# Altium project DCAR_MOTOR.PrjPcb
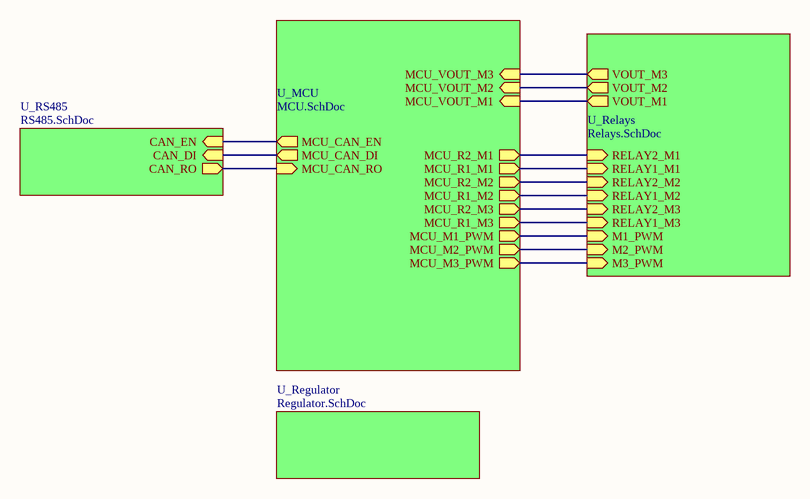
[diagram p0: Relay_top.SchDoc]
prjVersion: 2.0
5 sheets, 172 parts. Net scope: hierarchical (ports join the sheet entries above them; power ports are global).
Board file: PCB1.PcbDoc
Sheets:
  Relay_top.SchDoc
    U_MCU = MCU.SchDoc
    U_Relays = Relays.SchDoc
    U_RS485 = RS485.SchDoc
    U_Regulator = Regulator.SchDoc

## Sheet Relay_top.SchDoc: DCAR
size A4; DocumentNumber: 1; Revision: 2.0; SheetNumber: 1; SheetTotal: 5

### Sub-sheets
U_MCU = MCU.SchDoc: MCU_VOUT_M3 (in), MCU_VOUT_M1 (in), MCU_VOUT_M2 (in), MCU_CAN_RO (in), MCU_CAN_DI (out), MCU_CAN_EN (out), MCU_R2_M1 (out), MCU_R1_M1 (out), MCU_R2_M2 (out), MCU_R1_M2 (out), MCU_R2_M3 (out), MCU_R1_M3 (out), MCU_M1_PWM (out), MCU_M2_PWM (out), MCU_M3_PWM (out)
U_Regulator = Regulator.SchDoc: no entries
U_Relays = Relays.SchDoc: VOUT_M1 (out), VOUT_M3 (out), VOUT_M2 (out), RELAY2_M1 (in), RELAY1_M1 (in), RELAY2_M2 (in), RELAY1_M2 (in), RELAY2_M3 (in), RELAY1_M3 (in), M1_PWM (in), M2_PWM (in), M3_PWM (in)
U_RS485 = RS485.SchDoc: CAN_RO (out), CAN_EN (in), CAN_DI (in)

### Nets
EN: sheet U_MCU/MCU_CAN_EN, sheet U_RS485/CAN_EN
RX: sheet U_MCU/MCU_CAN_RO, sheet U_RS485/CAN_RO
TX: sheet U_MCU/MCU_CAN_DI, sheet U_RS485/CAN_DI
NetIC3_2: sheet U_MCU/MCU_M3_PWM, sheet U_Relays/M3_PWM
NetIC_2: sheet U_MCU/MCU_M1_PWM, sheet U_Relays/M1_PWM
NetIC_3: sheet U_MCU/MCU_M2_PWM, sheet U_Relays/M2_PWM
NetR13_1: sheet U_MCU/MCU_VOUT_M1, sheet U_Relays/VOUT_M1
NetR60_1: sheet U_MCU/MCU_VOUT_M2, sheet U_Relays/VOUT_M2
NetR61_1: sheet U_MCU/MCU_VOUT_M3, sheet U_Relays/VOUT_M3
NetU2_1: sheet U_MCU/MCU_R2_M1, sheet U_Relays/RELAY2_M1
NetU2_2: sheet U_MCU/MCU_R1_M1, sheet U_Relays/RELAY1_M1
NetU2_3: sheet U_MCU/MCU_R2_M2, sheet U_Relays/RELAY2_M2
NetU2_4: sheet U_MCU/MCU_R1_M2, sheet U_Relays/RELAY1_M2
NetU2_5: sheet U_MCU/MCU_R2_M3, sheet U_Relays/RELAY2_M3
NetU2_6: sheet U_MCU/MCU_R1_M3, sheet U_Relays/RELAY1_M3

### Notes on the sheet
- Title
- Size:
- Date:
- A4
- Number:
- Time:
- Revision:
- Sheet
- of
- NPN
- Lab
- File:

## Sheet MCU.SchDoc: MCU
size A3; DocumentNumber: 2; Revision: 2.0; SheetNumber: 2; SheetTotal: 5
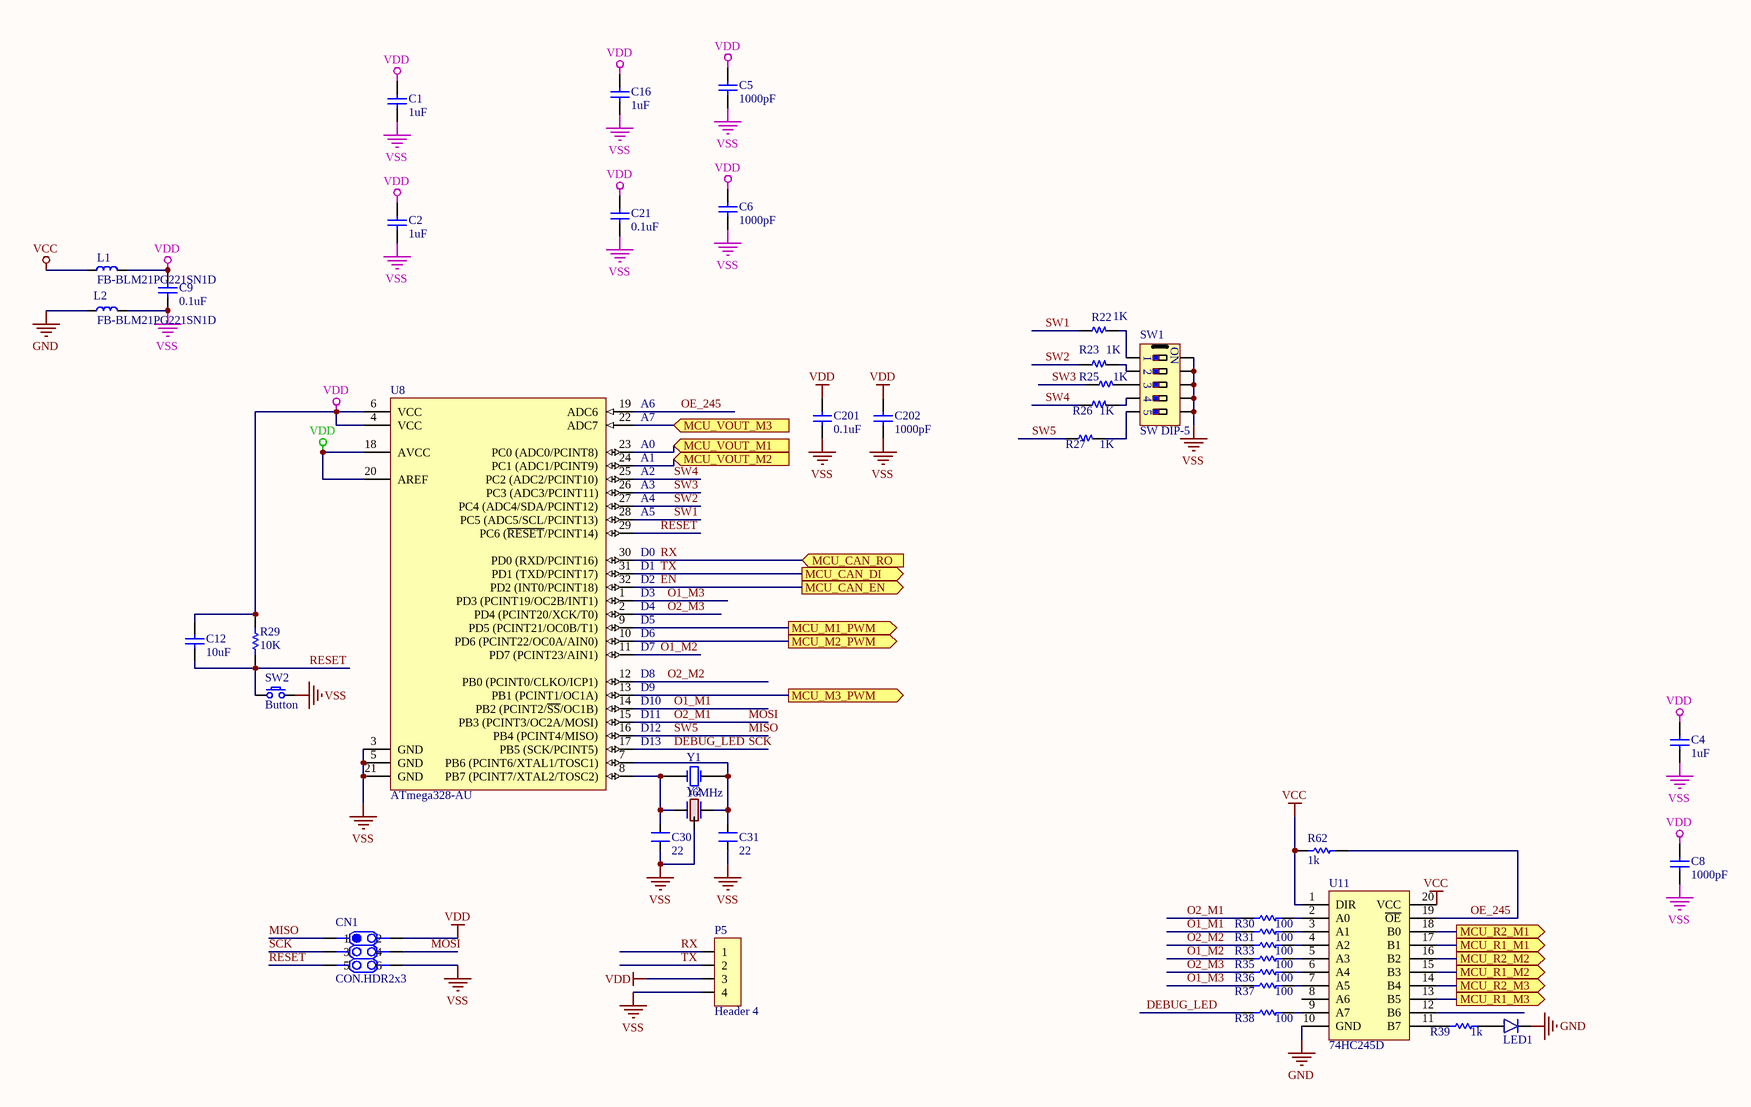
[diagram p1: MCU.SchDoc]

### Parts
C1  1uF  [C 0805 (2012)]
C2  1uF  [C 0805 (2012)]
C4  1uF  [C 0805 (2012)]
C5  1000pF  [C 0805 (2012)]
C6  1000pF  [C 0805 (2012)]
C8  1000pF  [C 0805 (2012)]
C9  0.1uF  [C 0805]
C12  10uF  [C 0805]
C16  1uF  [C 0805 (2012)]
C21  0.1uF  [C 0805 (2012)]
C30  22  [C 0805]
C31  22  [C 0805]
C201  0.1uF  [C 0805]
C202  1000pF  [C 0805]
CN1  CON.HDR2x3  [Header 3x2]
L1  FB-BLM21PG221SN1D  [L 0805 (2012)]
L2  FB-BLM21PG221SN1D  [L 0805 (2012)]
LED1  Led  [Led SMD 0805]  (value not drawn)
P5  Header 4  [Header 4]
R22  1K  [R 0805]
R23  1K  [R 0805]
R25  1K  [R 0805]
R26  1K  [R 0805]
R27  1K  [R 0805]
R29  10K  [R 0805]
R30  100  [R 0805]
R31  100  [R 0805]
R33  100  [R 0805]
R35  100  [R 0805]
R36  100  [R 0805]
R37  100  [R 0805]
R38  100  [R 0805]
R39  1k  [R 0805]
R62  1k  [R 0805]
SW1  SW DIP-5  [SW/DIP5/300]
SW2  Button  [SW/2/SMD]
U8  ATmega328-AU  [QFP32N]
U11  74HC245D  [SOIC-20]
Y1  16MHz  [XTAL]
Y2  (no value)  [Crystal SMD CSTCE]

### Ports
MCU_CAN_DI (out), MCU_CAN_EN (out), MCU_CAN_RO (in), MCU_M1_PWM (out), MCU_M2_PWM (out), MCU_M3_PWM (out), MCU_R1_M1 (out), MCU_R1_M2 (out), MCU_R1_M3 (out), MCU_R2_M1 (out), MCU_R2_M2 (out), MCU_R2_M3 (out), MCU_VOUT_M1 (in), MCU_VOUT_M2 (in), MCU_VOUT_M3 (in)

### Nets
GND: L2.1 LED1.2(K) U11.10(GND)
VCC: L1.1 R62.1 U11.1(DIR) U11.20(VCC)  [project net 5V]
VDD: C1.1 C2.1 C4.1 C5.1 C6.1 C8.1 C9.1 C12.1 C16.1 C21.1 C201.1 C202.1 CN1.2 L1.2 P5.3 R29.2 U8.4(VCC) U8.6(VCC) U8.18(AVCC) U8.20(AREF)
VSS: C1.2 C2.2 C4.2 C5.2 C6.2 C8.2 C9.2 C16.2 C21.2 C30.1 C31.1 C201.2 C202.2 CN1.6 L2.2 P5.4 SW1.6 SW1.7 SW1.8 SW1.9 SW1.10 SW2.2 U8.3(GND) U8.5(GND) U8.21(GND) Y2.2
DEBUG_LED: CN1.3 R38.1 U8.17(PB5_(SCK/PCINT5))  [also labelled SCK]
EN: U8.32(PD2_(INT0/PCINT18)) ; port MCU_CAN_EN
MISO: CN1.1 R27.1 U8.16(PB4_(PCINT4/MISO))  [also labelled SW5]
MOSI: CN1.4 R30.1 U8.15(PB3_(PCINT3/OC2A/MOSI))  [also labelled O2_M1]
O1_M1: R31.1 U8.14(PB2_(PCINT2/~{SS}/OC1B))
O1_M2: R35.1 U8.11(PD7_(PCINT23/AIN1))
O1_M3: R37.1 U8.1(PD3_(PCINT19/OC2B/INT1))
O2_M2: R33.1 U8.12(PB0_(PCINT0/CLKO/ICP1))
O2_M3: R36.1 U8.2(PD4_(PCINT20/XCK/T0))
OE_245: R62.2 U8.19(ADC6) U11.19(~{OE})
RESET: C12.2 CN1.5 R29.1 SW2.1 U8.29(PC6_(~{RESET}/PCINT14))
RX: P5.1 U8.30(PD0_(RXD/PCINT16)) ; port MCU_CAN_RO
SW1: R22.1 U8.28(PC5_(ADC5/SCL/PCINT13))
SW2: R23.1 U8.27(PC4_(ADC4/SDA/PCINT12))
SW3: R25.1 U8.26(PC3_(ADC3/PCINT11))
SW4: R26.1 U8.25(PC2_(ADC2/PCINT10))
TX: P5.2 U8.31(PD1_(TXD/PCINT17)) ; port MCU_CAN_DI
NetC30_2: C30.2 U8.8(PB7_(PCINT7/XTAL2/TOSC2)) Y1.1(OSC1) Y2.3
NetC31_2: C31.2 U8.7(PB6_(PCINT6/XTAL1/TOSC1)) Y1.2(OSC2) Y2.1
NetIC3_2: U8.13(PB1_(PCINT1/OC1A)) ; port MCU_M3_PWM
NetIC_2: U8.9(PD5_(PCINT21/OC0B/T1)) ; port MCU_M1_PWM
NetIC_3: U8.10(PD6_(PCINT22/OC0A/AIN0)) ; port MCU_M2_PWM
NetLED1_1: LED1.1(A) R39.2
NetR13_1: U8.23(PC0_(ADC0/PCINT8)) ; port MCU_VOUT_M1
NetR22_2: R22.2 SW1.1
NetR23_2: R23.2 SW1.2
NetR25_2: R25.2 SW1.3
NetR26_2: R26.2 SW1.4
NetR27_2: R27.2 SW1.5
NetR30_2: R30.2 U11.2(A0)
NetR31_2: R31.2 U11.3(A1)
NetR33_2: R33.2 U11.4(A2)
NetR35_2: R35.2 U11.5(A3)
NetR36_2: R36.2 U11.6(A4)
NetR37_2: R37.2 U11.7(A5)
NetR38_2: R38.2 U11.9(A7)
NetR39_1: R39.1 U11.11(B7)
NetR60_1: U8.24(PC1_(ADC1/PCINT9)) ; port MCU_VOUT_M2
NetR61_1: U8.22(ADC7) ; port MCU_VOUT_M3
NetU2_1: U11.18(B0) ; port MCU_R2_M1
NetU2_2: U11.17(B1) ; port MCU_R1_M1
NetU2_3: U11.16(B2) ; port MCU_R2_M2
NetU2_4: U11.15(B3) ; port MCU_R1_M2
NetU2_5: U11.14(B4) ; port MCU_R2_M3
NetU2_6: U11.13(B5) ; port MCU_R1_M3

Not connected (* = marked no-connect by the designer): U11 8(A6) 12(B6)

### Notes on the sheet
- (near U8) A6
- (near U8) A0
- (near U8) A1
- (near U8) A2
- (near U8) A7
- (near U8) A3
- (near U8) A4
- (near U8) A5
- (near U8) D2
- (near U8) D3
- (near U8) D4
- (near U8) D0
- (near U8) D1
- (near U8) D7
- (near U8) D8
- (near U8) D5
- (near U8) D6
- (near U8) D9
- (near U8) D10
- (near U8) D11
- D12
- D13
- Title
- Size:
- Date:
- Number:
- Time:
- Revision:
- Sheet
- of
- NPN
- Lab
- File:
- (in symbol SW DIP-5) ON

### Library data of the parts
C1 C2 C4-C6 C8 C12 C16 C21 C201 C202 = Capacitor NP: Capacitor non-pol
C9 = Capacitor NP: CAP CER 0.1UF 50V X7R 0603; TYPE: SMD; PACKAGE: SMD0603; STOCK CODE: CC0603KRX7R9BB104; SUPPLIER: tme.vn; STOCK DESC: 100nF/50V ±10% X7R SMD-0603 Capacitor; UNIT PRICE: 400
C30 C31 = CN2: Cap np 104 => 105pF; Value: 0.1uF
CN1 = CON.HDR2x3: Header 2x3; Publisher: Hoang Nguyen; ComponentLink1Description: Digikey Part link; ComponentLink2Description: Open DataSheet; ComponentLink2URL: H:\LIBRARY\LIBRARY.Datasheet\
L1 L2 = Inductor
LED1 = Led: Typical LED
P5 = Header 4: Header, 4-Pin
R22 R23 R25-R27 R29-R31 R33 R35-R39 R62 = Resistor
  R29: Published: 8-Jun-2000; LatestRevisionDate: 17-Jul-2002; LatestRevisionNote: Re-released for DXP Platform.; PackageReference: AXIAL-0.3; Publisher: Altium Limited; Value: 10K
  R30 R31 R33 R35-R39 R62: Published: 8-Jun-2000; LatestRevisionDate: 17-Jul-2002; LatestRevisionNote: Re-released for DXP Platform.; PackageReference: AXIAL-0.3; Publisher: Altium Limited
SW2 = SW SPST: Tact switch 2 pin
U8 = ATmega328-AU: 8-bit AVR Microcontroller, 32KB Flash, 1KB EEPROM, 2KB SRAM, 32-pin TQFP, Industrial Grade (-40°C to 85°C); Published: 1-Apr-2010; DatasheetVersion: revA, Jan-2010; PackageVersion: revB, Oct-2001; PackageReference: 32A; Publisher: Altium Limited; PackageDescription: 32-Lead, 7x7x1.0 mm Body, 0.8mm Lead Pitch, Thin Profile Plastic Quad Flat Package (TQFP); Supplier 1: Digi-Key; Supplier Part Number 1: ATMEGA328-AU-ND; Supplier 2: Mouser; Supplier Part Number 2: 556-ATMEGA328-AU; Code_JEDEC: MS-026-ABA; ComponentLink1Description: Manufacturer Link; ComponentLink1URL: http://www.atmel.com/products/avr/default.asp?; ComponentLink2Description: ATmega48A/48PA/88A/88PA/168A/168PA/328/328P Datasheet; ComponentLink2URL: http://www.atmel.com/dyn/resources/prod_documents/8271.pdf; ComponentLink3Description: ATmega48A/48PA/88A/88PA/168A/168PA/328/328P Summary; ComponentLink3URL: http://www.atmel.com/dyn/resources/prod_documents/8271S.pdf; ComponentLink4Description: Atmel.com Home; ComponentLink4URL: http://www.atmel.com
U11 = 74HC245D: IC TRANSCVR NON-INVERT 6V 20SO
Y1 = XTAL: Crystal Oscillator; Published: 8-Jun-2000; LatestRevisionDate: 17-Jul-2002; LatestRevisionNote: Re-released for DXP Platform.; PackageReference: R38; Publisher: Altium Limited
Y2 = Crystal CSTCE

## Sheet Relays.SchDoc: RELAY
size A2; DocumentNumber: 5; Revision: 2.0; SheetNumber: 5; SheetTotal: 5
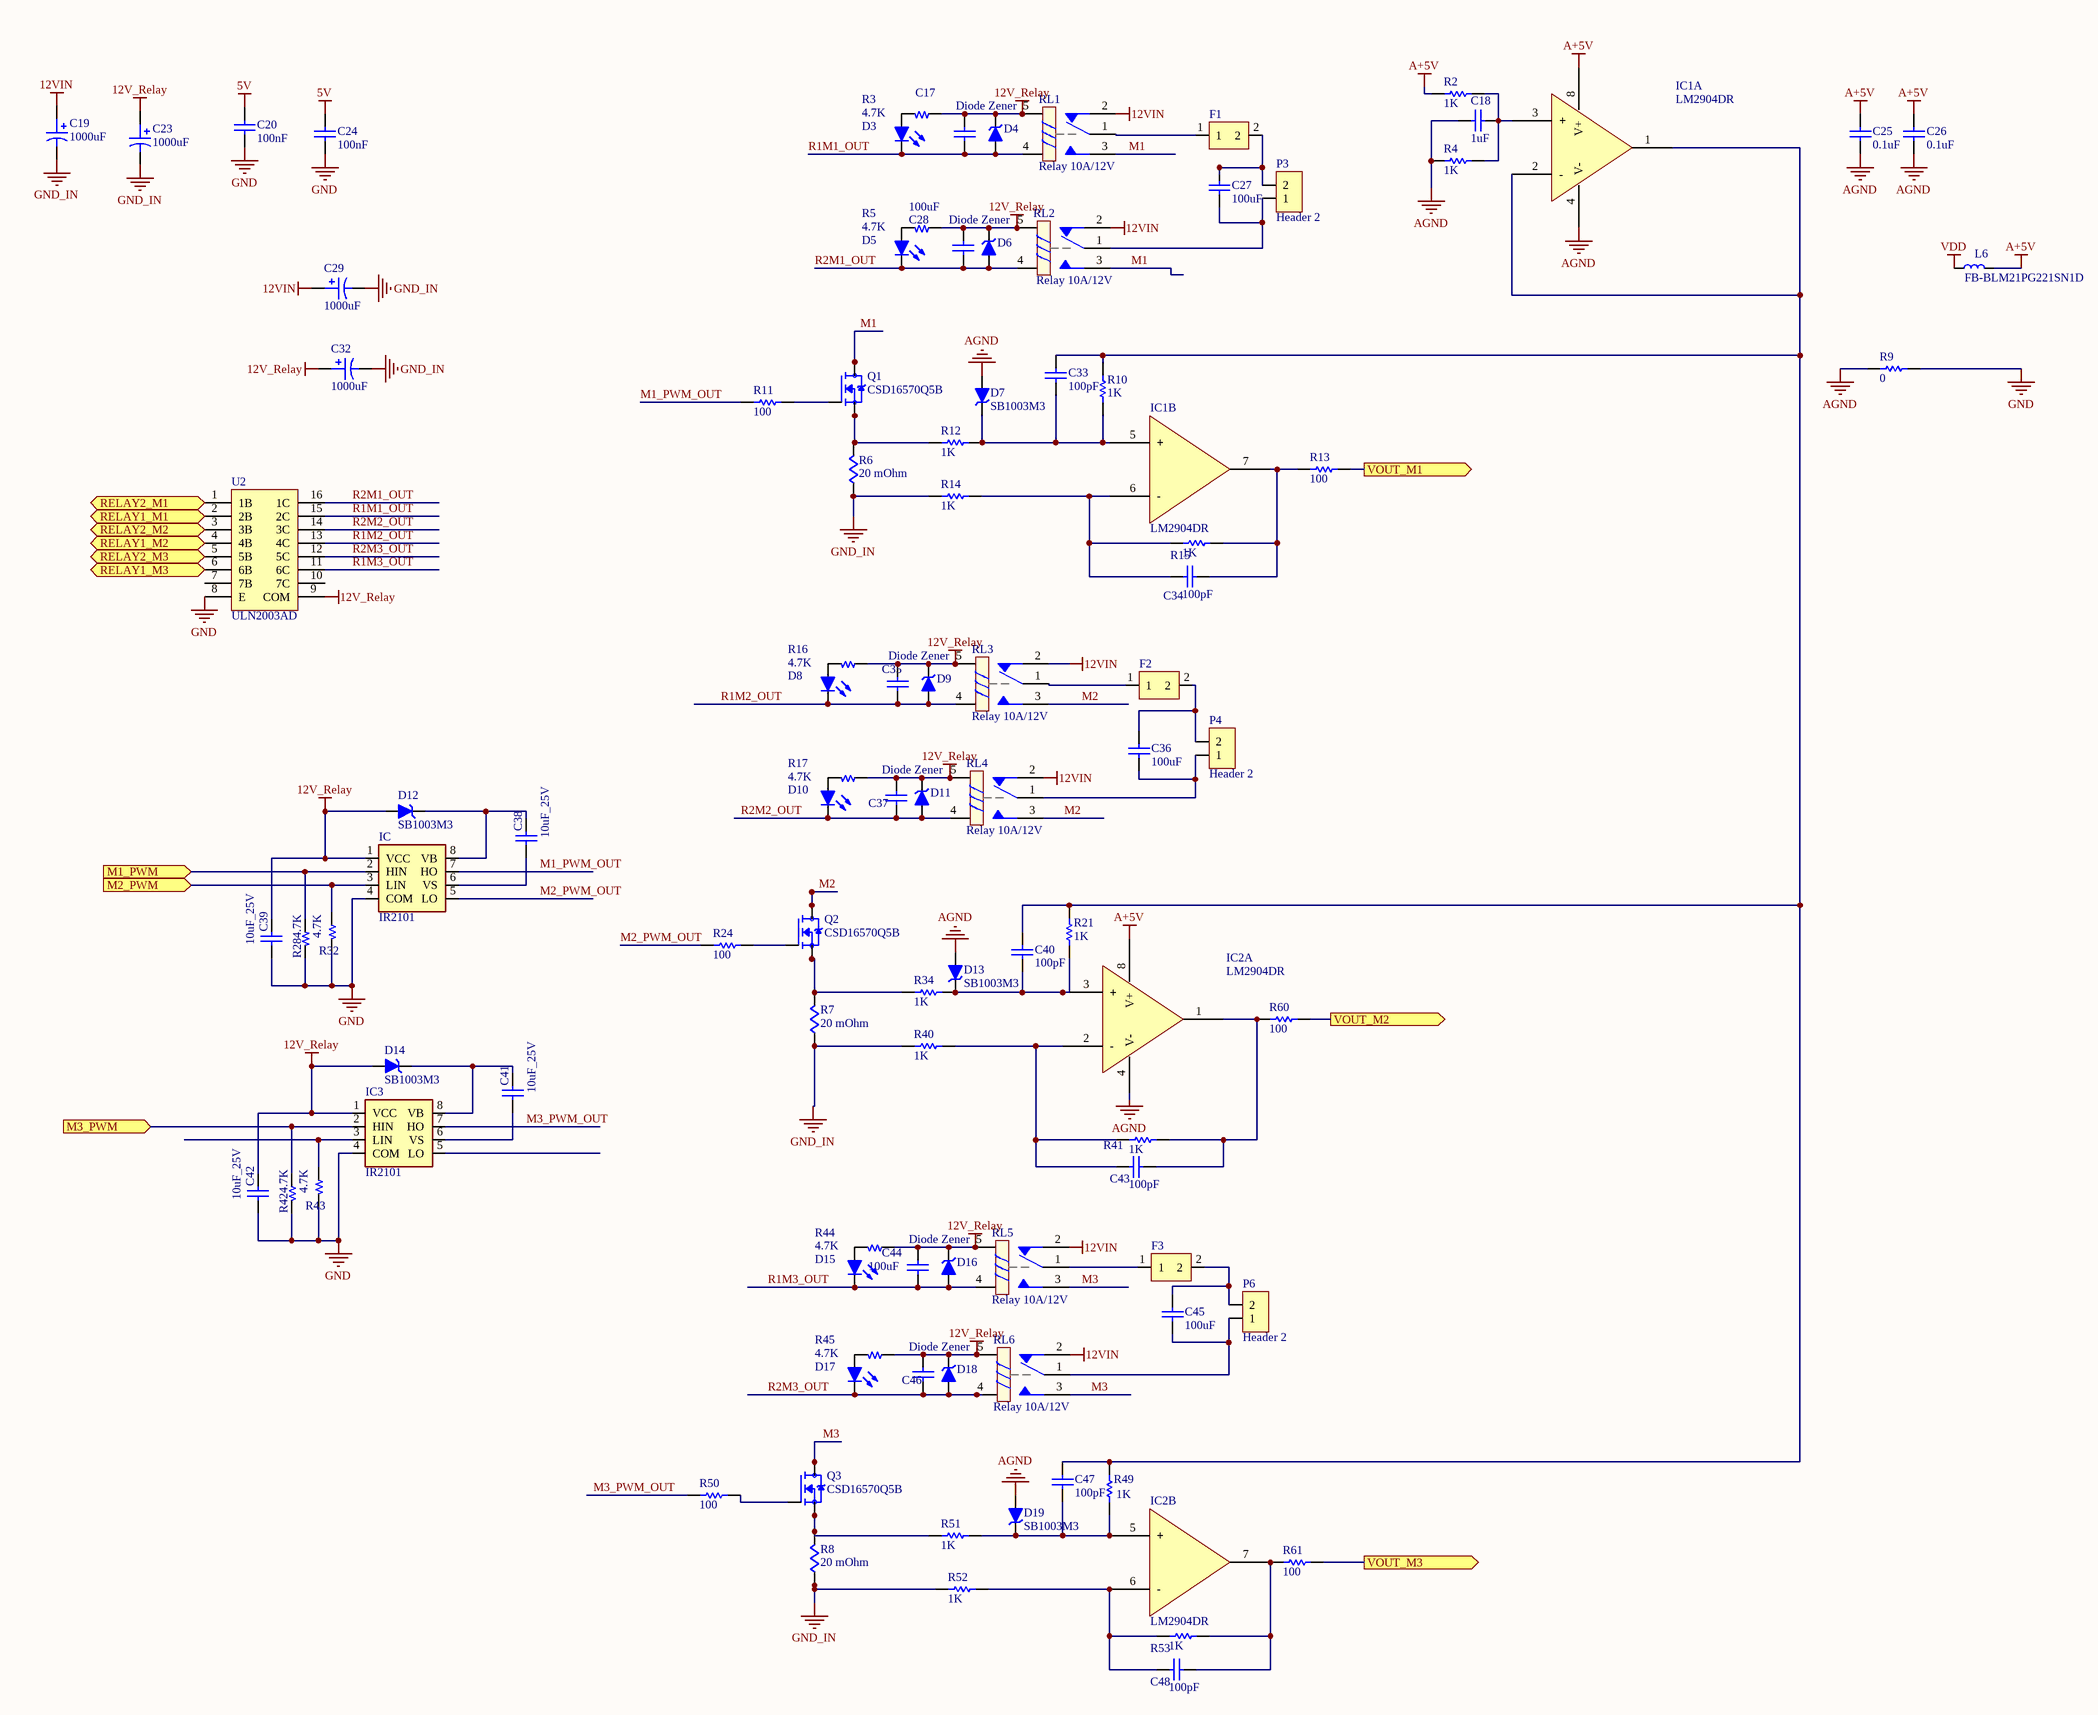
[diagram p2: Relays.SchDoc]

### Parts
C17  Cap Non-pol  [C 0805]  (value not drawn)
C18  value 1uF  [C 0805]  (hidden comment: Cap Non-pol)
C19  value 1000uF  [CAP/D100/H200/LS50]  (hidden comment: Cap Pol)
C20  value 100nF  [C 0805]  (hidden comment: Cap Non-pol)
C23  value 1000uF  [CAP/D100/H200/LS50]  (hidden comment: Cap Pol)
C24  value 100nF  [C 0805]  (hidden comment: Cap Non-pol)
C25  value 0.1uF  [C 0805]  (hidden comment: Cap Non-pol)
C26  value 0.1uF  [C 0805]  (hidden comment: Cap Non-pol)
C27  value 100uF  [CAP Ceramic/W200]  (hidden comment: Cap Non-pol)
C28  value 100uF  [C 0805]  (hidden comment: Cap Non-pol)
C29  value 1000uF  [CAP/D100/H200/LS50]  (hidden comment: Cap Pol)
C32  value 1000uF  [CAP/D100/H200/LS50]  (hidden comment: Cap Pol)
C33  value 100pF  [C 0805]  (hidden comment: Cap Non-pol)
C34  value 100pF  [C 0805]  (hidden comment: Cap Non-pol)
C35  Cap Non-pol  [C 0805]  (value not drawn)
C36  value 100uF  [CAP Ceramic/W200]  (hidden comment: Cap Non-pol)
C37  Cap Non-pol  [C 0805]  (value not drawn)
C38  10uF_25V  [C 0805]
C39  10uF_25V  [C 0805]
C40  value 100pF  [C 0805]  (hidden comment: Cap Non-pol)
C41  10uF_25V  [C 0805]
C42  10uF_25V  [C 0805]
C43  value 100pF  [C 0805]  (hidden comment: Cap Non-pol)
C44  value 100uF  [C 0805]  (hidden comment: Cap Non-pol)
C45  value 100uF  [CAP Ceramic/W200]  (hidden comment: Cap Non-pol)
C46  Cap Non-pol  [C 0805]  (value not drawn)
C47  value 100pF  [C 0805]  (hidden comment: Cap Non-pol)
C48  value 100pF  [C 0805]  (hidden comment: Cap Non-pol)
D3  Led  [Led 0805 RED]  (value not drawn)
D4  Diode Zener  [SOD80C Wave]
D5  Led  [Led 0805 RED]  (value not drawn)
D6  Diode Zener  [SOD80C Wave]
D7  SB1003M3  [DO-214AC (SMA)]
D8  Led  [Led 0805 RED]  (value not drawn)
D9  Diode Zener  [SOD80C Wave]
D10  Led  [Led 0805 RED]  (value not drawn)
D11  Diode Zener  [SOD80C Wave]
D12  SB1003M3  [DO-214AC (SMA)]
D13  SB1003M3  [DO-214AC (SMA)]
D14  SB1003M3  [DO-214AC (SMA)]
D15  Led  [Led 0805 RED]  (value not drawn)
D16  Diode Zener  [SOD80C Wave]
D17  Led  [Led 0805 RED]  (value not drawn)
D18  Diode Zener  [SOD80C Wave]
D19  SB1003M3  [DO-214AC (SMA)]
F1  FUSE_DCAR_HOLDER  [DCAR Fuse holder]  (value not drawn)
F2  FUSE_DCAR_HOLDER  [DCAR Fuse holder]  (value not drawn)
F3  FUSE_DCAR_HOLDER  [DCAR Fuse holder]  (value not drawn)
IC  IR2101  [SOIC-8-I/SN]
IC1  LM2904DR  [SOIC-8-I/SN]  (parts A,B of 2)
IC2  LM2904DR  [SOIC-8-I/SN]  (parts A,B of 2)
IC3  IR2101  [SOIC-8-I/SN]
L6  FB-BLM21PG221SN1D  [L 0805 (2012)]
P3  Header 2  [HDR Domino 2]
P4  Header 2  [HDR Domino 2]
P6  Header 2  [HDR Domino 2]
Q1  CSD16570Q5B  [TRANS_CSD19502Q5BT]
Q2  CSD16570Q5B  [TRANS_CSD19502Q5BT]
Q3  CSD16570Q5B  [TRANS_CSD19502Q5BT]
R2  1K  [R 0805]
R3  4.7K  [R 0805]
R4  1K  [R 0805]
R5  4.7K  [R 0805]
R6  value 20 mOhm  [R2512]  (hidden comment: Resistor2)
R7  value 20 mOhm  [R2512]  (hidden comment: Resistor2)
R8  value 20 mOhm  [R2512]  (hidden comment: Resistor2)
R9  0  [R 0805]
R10  1K  [R 0805]
R11  100  [R 0805]
R12  1K  [R 0805]
R13  100  [R 0805]
R14  1K  [R 0805]
R15  1K  [R 0805]
R16  4.7K  [R 0805]
R17  4.7K  [R 0805]
R21  1K  [R 0805]
R24  100  [R 0805]
R28  4.7K  [R 0805]
R32  4.7K  [R 0805]
R34  1K  [R 0805]
R40  1K  [R 0805]
R41  1K  [R 0805]
R42  4.7K  [R 0805]
R43  4.7K  [R 0805]
R44  4.7K  [R 0805]
R45  4.7K  [R 0805]
R49  1K  [R 0805]
R50  100  [R 0805]
R51  1K  [R 0805]
R52  1K  [R 0805]
R53  1K  [R 0805]
R60  100  [R 0805]
R61  100  [R 0805]
RL1  Relay 10A/12V  [RL_SPDT_20A_SMALL]
RL2  Relay 10A/12V  [RL_SPDT_20A_SMALL]
RL3  Relay 10A/12V  [RL_SPDT_20A_SMALL]
RL4  Relay 10A/12V  [RL_SPDT_20A_SMALL]
RL5  Relay 10A/12V  [RL_SPDT_20A_SMALL]
RL6  Relay 10A/12V  [RL_SPDT_20A_SMALL]
U2  ULN2003AD  [SOIC-16]

### Ports
M1_PWM (in), M2_PWM (in), M3_PWM (in), RELAY1_M1 (in), RELAY1_M2 (in), RELAY1_M3 (in), RELAY2_M1 (in), RELAY2_M2 (in), RELAY2_M3 (in), VOUT_M1 (out), VOUT_M2 (out), VOUT_M3 (out)

### Nets
5V: C20.2 C24.2
12V_Relay: C17.2 C23.1 C28.2 C32.1 C35.2 C37.2 C39.2 C42.2 C44.2 C46.2 D4.2(K) D6.2(K) D9.2(K) D11.2(K) D12.1(A) D14.1(A) D16.2(K) D18.2(K) IC.1(VCC) IC3.1(VCC) R3.1 R5.1 R16.1 R17.1 R44.1 R45.1 RL1.5 RL2.5 RL3.5 RL4.5 RL5.5 RL6.5 U2.9(COM)
12VIN: C19.1 C29.1 RL1.2 RL2.2 RL3.2 RL4.2 RL5.2 RL6.2
A+5V: C25.2 C26.2 IC1.8(V+) IC2.8(V+) L6.2 R2.1
AGND: C18.2 C25.1 C26.1 D7.1(A) D13.1(A) D19.1(A) IC1.4(V-) IC2.4(V-) R4.1 R9.1
GND: C20.1 C24.1 C39.1 C42.1 IC.4(COM) IC3.4(COM) R9.2 R28.2 R32.2 R42.2 R43.2 U2.8(E)
GND_IN: C19.2 C23.2 C29.2 C32.2 R6.1 R7.1 R8.1 R14.2 R40.2 R52.2
VDD: L6.1
M1: Q1.9(D) Q1.9_1(D) Q1.9_2(D) Q1.9_3(D) Q1.9_4(D) Q1.9_5(D) Q1.9_6(D) Q1.9_7(D) RL1.3 RL2.3
M1_PWM_OUT: IC.7(HO) R11.2
M2: Q2.9(D) Q2.9_1(D) Q2.9_2(D) Q2.9_3(D) Q2.9_4(D) Q2.9_5(D) Q2.9_6(D) Q2.9_7(D) RL3.3 RL4.3
M2_PWM_OUT: IC.5(LO) R24.2
M3: Q3.9(D) Q3.9_1(D) Q3.9_2(D) Q3.9_3(D) Q3.9_4(D) Q3.9_5(D) Q3.9_6(D) Q3.9_7(D) RL5.3 RL6.3
M3_PWM_OUT: IC3.7(HO) R50.2
R1M1_OUT: C17.1 D3.2(K) D4.1(A) RL1.4 U2.15(2C)
R1M2_OUT: C35.1 D8.2(K) D9.1(A) RL3.4 U2.13(4C)
R1M3_OUT: C44.1 D15.2(K) D16.1(A) RL5.4 U2.11(6C)
R2M1_OUT: C28.1 D5.2(K) D6.1(A) RL2.4 U2.16(1C)
R2M2_OUT: C37.1 D10.2(K) D11.1(A) RL4.4 U2.14(3C)
R2M3_OUT: C46.1 D17.2(K) D18.1(A) RL6.4 U2.12(5C)
NetC18_1: C18.1 IC1.3(+) R2.2 R4.2
NetC27_1: C27.1 P3.1 RL2.1
NetC27_2: C27.2 F1.2 P3.2
NetC33_1: C33.1 C40.1 C47.1 IC1.1(OUTA) IC1.2(-) R10.1 R21.1 R49.1
NetC33_2: C33.2 D7.2(K) IC1.5(+) R10.2 R12.1
NetC34_1: C34.1 IC1.7(OUTB) R13.2 R15.1
NetC34_2: C34.2 IC1.6(-) R14.1 R15.2
NetC36_1: C36.1 P4.1 RL4.1
NetC36_2: C36.2 F2.2 P4.2
NetC38_1: C38.1 IC.6(VS)
NetC38_2: C38.2 D12.2(K) IC.8(VB)
NetC40_2: C40.2 D13.2(K) IC2.3(+) R21.2 R34.1
NetC41_1: C41.1 IC3.6(VS)
NetC41_2: C41.2 D14.2(K) IC3.8(VB)
NetC43_1: C43.1 IC2.1(OUTA) R41.1 R60.2
NetC43_2: C43.2 IC2.2(-) R40.1 R41.2
NetC45_1: C45.1 P6.1 RL6.1
NetC45_2: C45.2 F3.2 P6.2
NetC47_2: C47.2 D19.2(K) IC2.5(+) R49.2 R51.1
NetC48_1: C48.1 IC2.7(OUTB) R53.1 R61.2
NetC48_2: C48.2 IC2.6(-) R52.1 R53.2
NetD3_1: D3.1(A) R3.2
NetD5_1: D5.1(A) R5.2
NetD8_1: D8.1(A) R16.2
NetD10_1: D10.1(A) R17.2
NetD15_1: D15.1(A) R44.2
NetD17_1: D17.1(A) R45.2
NetF1_1: F1.1 RL1.1
NetF2_1: F2.1 RL3.1
NetF3_1: F3.1 RL5.1
NetIC3_2: IC3.2(HIN) R42.1 ; port M3_PWM
NetIC3_3: IC3.3(LIN) R43.1
NetIC_2: IC.2(HIN) R28.1 ; port M1_PWM
NetIC_3: IC.3(LIN) R32.1 ; port M2_PWM
NetQ1_1: Q1.1(S) Q1.2(S) Q1.3(S) R6.2 R12.2
NetQ1_4: Q1.4(G) R11.1
NetQ2_1: Q2.1(S) Q2.2(S) Q2.3(S) R7.2 R34.2
NetQ2_4: Q2.4(G) R24.1
NetQ3_1: Q3.1(S) Q3.2(S) Q3.3(S) R8.2 R51.2
NetQ3_4: Q3.4(G) R50.1
NetR13_1: R13.1 ; port VOUT_M1
NetR60_1: R60.1 ; port VOUT_M2
NetR61_1: R61.1 ; port VOUT_M3
NetU2_1: U2.1(1B) ; port RELAY2_M1
NetU2_2: U2.2(2B) ; port RELAY1_M1
NetU2_3: U2.3(3B) ; port RELAY2_M2
NetU2_4: U2.4(4B) ; port RELAY1_M2
NetU2_5: U2.5(5B) ; port RELAY2_M3
NetU2_6: U2.6(6B) ; port RELAY1_M3

Not connected (* = marked no-connect by the designer): IC3 5(LO); U2 7(7B) 10(7C)

### Notes on the sheet
- Title
- Size:
- Date:
- File:
- A4
- Number:
- Time:
- Revision:
- Sheet
- of
- NPN
- Lab

### Library data of the parts
C17 C18 C20 C24-C28 C33-C48 = Cap Non-pol: Non-polarized Capacitor; Published: 8-Jun-2000; LatestRevisionDate: 17-Jul-2002; LatestRevisionNote: Re-released for DXP Platform.; PackageReference: RAD-0.3; Publisher: Altium Limited
C19 C23 C29 C32 = Cap Pol: Polarized Capacitor; Published: 8-Jun-2000; LatestRevisionDate: 17-Jul-2002; LatestRevisionNote: Re-released for DXP Platform.; PackageReference: POLAR0.8; Publisher: Altium Limited
D3 D5 D8 D10 D15 D17 = Led: LED RED CLEAR 0805 SMD; PACKAGE: SMD0805; STOCK CODE: HT17-2102SURC; SUPPLIER: tme.vn; TYPE: SMD; STOCK DESC: SMD-0805 High Bright Red Chip LED; UNIT PRICE: 800
D4 D6 D7 D9 D11-D14 D16 D18 D19 = Diode Zener: Zener Diode
  D4 D6 D9 D11 D16 D18: Published: 8-Jun-2000; LatestRevisionDate: 17-Jul-2002; LatestRevisionNote: Re-released for DXP Platform.; PackageReference: DIODE-0.7; Publisher: Altium Limited
IC IC3 = IR2101: Half-Bridge Gate Driver IC Non-Inverting 8-SOIC; MF: Infineon; Availability: Unavailable; Package: DIP-8 International Rectifier; MP: IR2101; SnapEDA_Link: https://www.snapeda.com/parts/IR2101/Infineon%20Technologies/view-part/41866/?ref=snap; Value: *; Price: None
IC1 IC2 = LM2904DR: IC OPAMP GP 2 CIRCUIT 8SOIC; Manufacturer: Texas Instruments; Amplifier Type: General Purpose; Current - Input Bias: 20nA; Current - Output / Channel: 30mA; Current - Supply: 1mA; Gain Bandwidth Product: 700kHz; Number of Circuits: 2; Slew Rate: 0.3V/µs; Voltage - Input Offset: 3mV; Voltage - Supply, Single/Dual (±): 3V ~ 26V, ±1.5V ~ 13V; Part Number: LM2904DR; ComponentLink1Description: Datasheet; ComponentLink1URL: http://www.ti.com/general/docs/suppproductinfo.tsp?distId=10&gotoUrl=http%3A%2F%2Fwww.ti.com%2Flit%2Fgpn%2Flm258a; ComponentLink2Description: DigiKey Link; ComponentLink2URL: http://digikey.com/product-detail/en/texas-instruments/LM2904DR/296-14596-1-ND/555533; Device Package: 8-SOIC (0.154", 3.90mm Width); LastUpdated: 1/9/2020 2:06:28 AM; Lifecycle Status: Active; Minimum Order: 1; Mounting Type: Surface Mount; Operating Temperature: -40°C ~ 125°C; Package / Case: 8-SOIC (0.154", 3.90mm Width); Packaging: ReReel; PartId: 4; Part Status: Active; Price: 0.00; Series: -; Supplier 1: DigiKey; Supplier Part Number 1: 296-14596-1-ND; Supplier Device Package: 8-SOIC
L6 = Inductor
P3 P4 P6 = Header 2: Header, 2-Pin; LatestRevisionDate: 17-Jul-2002; LatestRevisionNote: Re-released for DXP Platform.; Publisher: Altium Limited
Q1-Q3 = CSD17577Q3A: N-Channel 30V 35A _Ta_ 2.8W _Ta_, 53W _Tc_ Surface Mount 8-VSONP _3x3.15_; MF: Texas Instruments; MP: CSD17577Q3A; SnapEDA_Link: https://www.snapeda.com/parts/CSD17577Q3A/Texas%20Instruments/view-part/486367/?ref=snap; Availability: Unavailable; Package: VSON-8 Texas Instruments; Value: *; Price: None
R2 R4 R9-R15 R21 R24 R34 R40 R41 R49-R53 R60 R61 = Resistor: Published: 8-Jun-2000; LatestRevisionDate: 17-Jul-2002; LatestRevisionNote: Re-released for DXP Platform.; PackageReference: AXIAL-0.3; Publisher: Altium Limited
R3 R5 R16 R17 R28 R32 R42-R45 = Resistor: RES SMD 4.7K OHM 1% 1/10W 0805; PACKAGE: SMD0805; STOCK CODE: RM10JTN472; SUPPLIER: tme.vn; TYPE: SMD; STOCK DESC: 4.7K 5% SMD-0805 Resistor; UNIT PRICE: 60
RL1-RL6 = Relay 1: Relay SPDT,10A - 12VDC 5 Pin; Value: Relay SPDT, 10A, 12V
U2 = ULN2003: IC PWR RELAY 7NPN 1:1 16SOIC; BRAND: Texas Instruments; PACKAGE: SOIC-16; PART NO: ULN2003AD; STOCK CODE: ULN2003AD; SUPPLIER: tme.vn; TYPE: SMD; STOCK DESC: TRANS 7 NPN DARL 50V 500MA 16SO; UNIT PRICE: 5000
R6-R8 = Resistor2: Manufacturer: *; Manufacturer Part No: *; Component Type: Resistor; Supplier: *; Order Code: *

## Sheet RS485.SchDoc: RS485
size A4; DocumentNumber: 4; Revision: 2.0; SheetNumber: 4; SheetTotal: 5
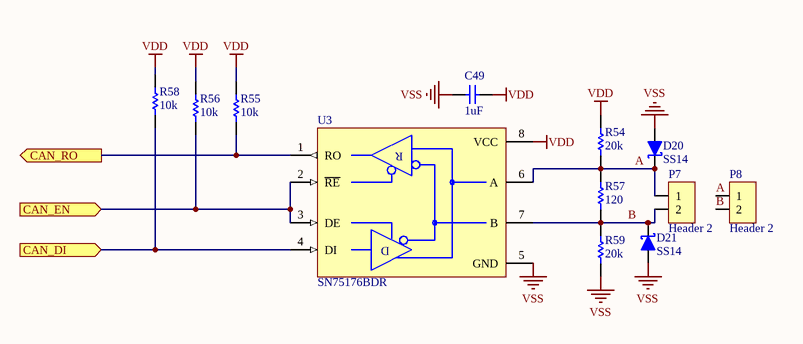
[diagram p3: RS485.SchDoc]

### Parts
C49  1uF  [C 0805]
D20  SS14  [DO-214AC (SMA)]
D21  SS14  [DO-214AC (SMA)]
P7  Header 2  [HDR/Terminal/2/5mm/RA]
P8  Header 2  [HDR/Terminal/2/5mm/RA]
R54  20k  [R 0805]
R55  10k  [R 0805]
R56  10k  [R 0805]
R57  120  [R 0805]
R58  10k  [R 0805]
R59  20k  [R 0805]
U3  SN75176BDR  [SOIC-8]

### Ports
CAN_DI (in), CAN_EN (in), CAN_RO (out)

### Nets
VDD: C49.1 R54.2 R55.1 R56.2 R58.2 U3.8(VCC)
VSS: C49.2 D20.1(A) D21.1(A) R59.1 U3.5(GND)
A: D20.2(K) P7.1 P8.1 R54.1 R57.2 U3.6(A)
B: D21.2(K) P7.2 P8.2 R57.1 R59.2 U3.7(B)
EN: R56.1 U3.2(~{RE}) U3.3(DE) ; port CAN_EN
RX: R55.2 U3.1(RO) ; port CAN_RO
TX: R58.1 U3.4(DI) ; port CAN_DI

### Notes on the sheet
- Title
- Size:
- Date:
- A4
- Number:
- Time:
- Revision:
- Sheet
- of
- NPN
- Lab
- File:
- (in symbol MAX485) R; D

### Library data of the parts
C49 = Capacitor NP: Capacitor non-pol
D20 D21 = Diode Schottky: Schottky Diode; Published: 8-Jun-2000; LatestRevisionDate: 17-Jul-2002; LatestRevisionNote: Re-released for DXP Platform.; PackageReference: SMB; Publisher: Altium Limited; Code_JEDEC: DO-214-AA
P7 P8 = Header 2: Header, 2-Pin; LatestRevisionDate: 17-Jul-2002; LatestRevisionNote: Re-released for DXP Platform.; Publisher: Altium Limited
R54-R59 = Resistor: Published: 8-Jun-2000; LatestRevisionDate: 17-Jul-2002; LatestRevisionNote: Re-released for DXP Platform.; PackageReference: AXIAL-0.3; Publisher: Altium Limited
U3 = MAX485

## Sheet Regulator.SchDoc: Regulator
size A4; DocumentNumber: 3; Revision: 2.0; SheetNumber: 3; SheetTotal: 5
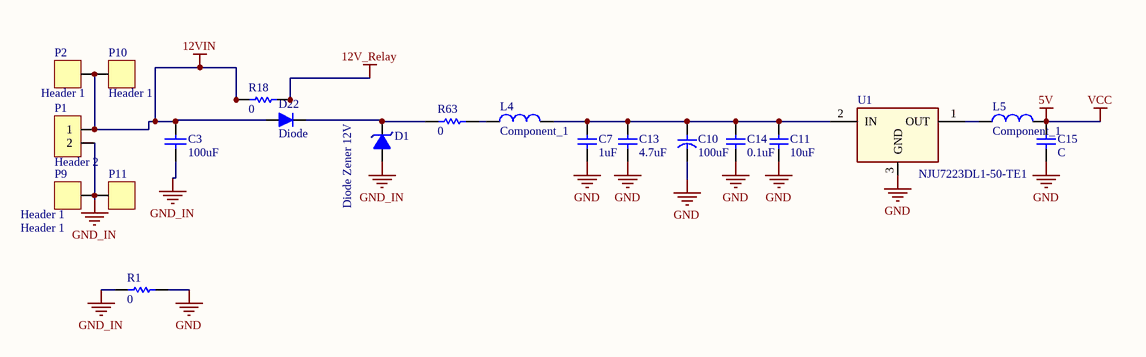
[diagram p4: Regulator.SchDoc]

### Parts
C3  value 100uF  [Cap Non-Pol 5mm]  (hidden comment: Cap Non-pol)
C7  1uF  [C 0805 (2012)]
C10  100uF  [C SMD ALU (B)]
C11  10uF  [C 0805]
C13  4.7uF  [C 0805 (2012)]
C14  0.1uF  [C 0805]
C15  C  [C 0805]
D1  Diode Zener 12V  [DO-214AC (SMA)]
D22  Diode  [DO-214AC (SMA)]
L4  Component_1  [C 1210]
L5  Component_1  [C 1210]
P1  Header 2  [HDR Domino 2]
P2  Header 1  [HDR/Terminal/1/screw]
P9  Header 1  [HDR/Terminal/1/screw]
P10  Header 1  [HDR/Terminal/1/copper/6.0]
P11  Header 1  [HDR/Terminal/1/copper/6.0]
R1  0  [R 0805]
R18  0  [R 0805 (2012)]
R63  0  [R 0805]
U1  NJU7223DL1-50-TE1  [TO-252 (DPAK)]

### Nets
5V: C15.1 L5.2  [also labelled VCC]
12V_Relay: R18.2
12VIN: C3.2 D22.1(A) P1.1 P2.1 P10.1 R18.1
GND: C7.2 C10.2 C11.2 C13.2 C14.2 C15.2 R1.1 U1.3(GND)
GND_IN: C3.1 D1.1(A) P1.2 P9.1 P11.1 R1.2
NetC7_1: C7.1 C10.1 C11.1 C13.1 C14.1 L4.2 U1.2(IN)
NetD1_2: D1.2(K) D22.2(K) R63.2
NetL4_1: L4.1 R63.1
NetL5_1: L5.1 U1.1(OUT)

### Notes on the sheet
- Title
- Size:
- Date:
- A4
- Number:
- Time:
- Revision:
- Sheet
- of
- NPN
- Lab
- File:

### Library data of the parts
C3 = Cap Non-pol: Non-polarized Capacitor; Published: 8-Jun-2000; LatestRevisionDate: 17-Jul-2002; LatestRevisionNote: Re-released for DXP Platform.; PackageReference: RAD-0.3; Publisher: Altium Limited
C7 C11 C13-C15 = Capacitor NP: Capacitor non-pol
C10 = Capacitor: Capacitor pol
D1 = Zener
D22 = Diode: Default Diode
P1 = Header 2: Header, 2-Pin; LatestRevisionDate: 17-Jul-2002; LatestRevisionNote: Re-released for DXP Platform.; Publisher: Altium Limited
P2 P9-P11 = Header 1: Header, 1-Pin
R1 R18 R63 = Resistor: Published: 8-Jun-2000; LatestRevisionDate: 17-Jul-2002; LatestRevisionNote: Re-released for DXP Platform.; PackageReference: AXIAL-0.3; Publisher: Altium Limited
U1 = 78xx: LDO Fixed Voltage regulator

## Nets that join several sheets
5V: MCU (L1.1 R62.1 U11.1 U11.20), Relays (C20.2 C24.2), Regulator (C15.1 L5.2)
12V_Relay: Relays (33 pins), Regulator (R18.2)
12VIN: Relays (8 pins), Regulator (6 pins)
GND: MCU (L2.1 LED1.2 U11.10), Relays (12 pins), Regulator (8 pins)
GND_IN: Relays (10 pins), Regulator (6 pins)
VDD: MCU (20 pins), Relays (L6.1), RS485 (6 pins)
VSS: MCU (26 pins), RS485 (5 pins)
EN: MCU (U8.32), RS485 (R56.1 U3.2 U3.3)
NetIC3_2: MCU (U8.13), Relays (IC3.2 R42.1)
NetIC_2: MCU (U8.9), Relays (IC.2 R28.1)
NetIC_3: MCU (U8.10), Relays (IC.3 R32.1)
NetR13_1: MCU (U8.23), Relays (R13.1)
NetR60_1: MCU (U8.24), Relays (R60.1)
NetR61_1: MCU (U8.22), Relays (R61.1)
NetU2_1: MCU (U11.18), Relays (U2.1)
NetU2_2: MCU (U11.17), Relays (U2.2)
NetU2_3: MCU (U11.16), Relays (U2.3)
NetU2_4: MCU (U11.15), Relays (U2.4)
NetU2_5: MCU (U11.14), Relays (U2.5)
NetU2_6: MCU (U11.13), Relays (U2.6)
RX: MCU (P5.1 U8.30), RS485 (R55.2 U3.1)
TX: MCU (P5.2 U8.31), RS485 (R58.1 U3.4)